# Altium schematic sheet MCU.SchDoc: Microcontroller
size A3; Organization: Senior Design Project; Address1: Prosthetic Hand; Address2: Matthew Varas; Address3: Rachel Mertz; Address4: Donnell Jones; DocumentNumber: 3; Revision: 1.1; SheetNumber: 3; SheetTotal: 6; DocumentName: 3
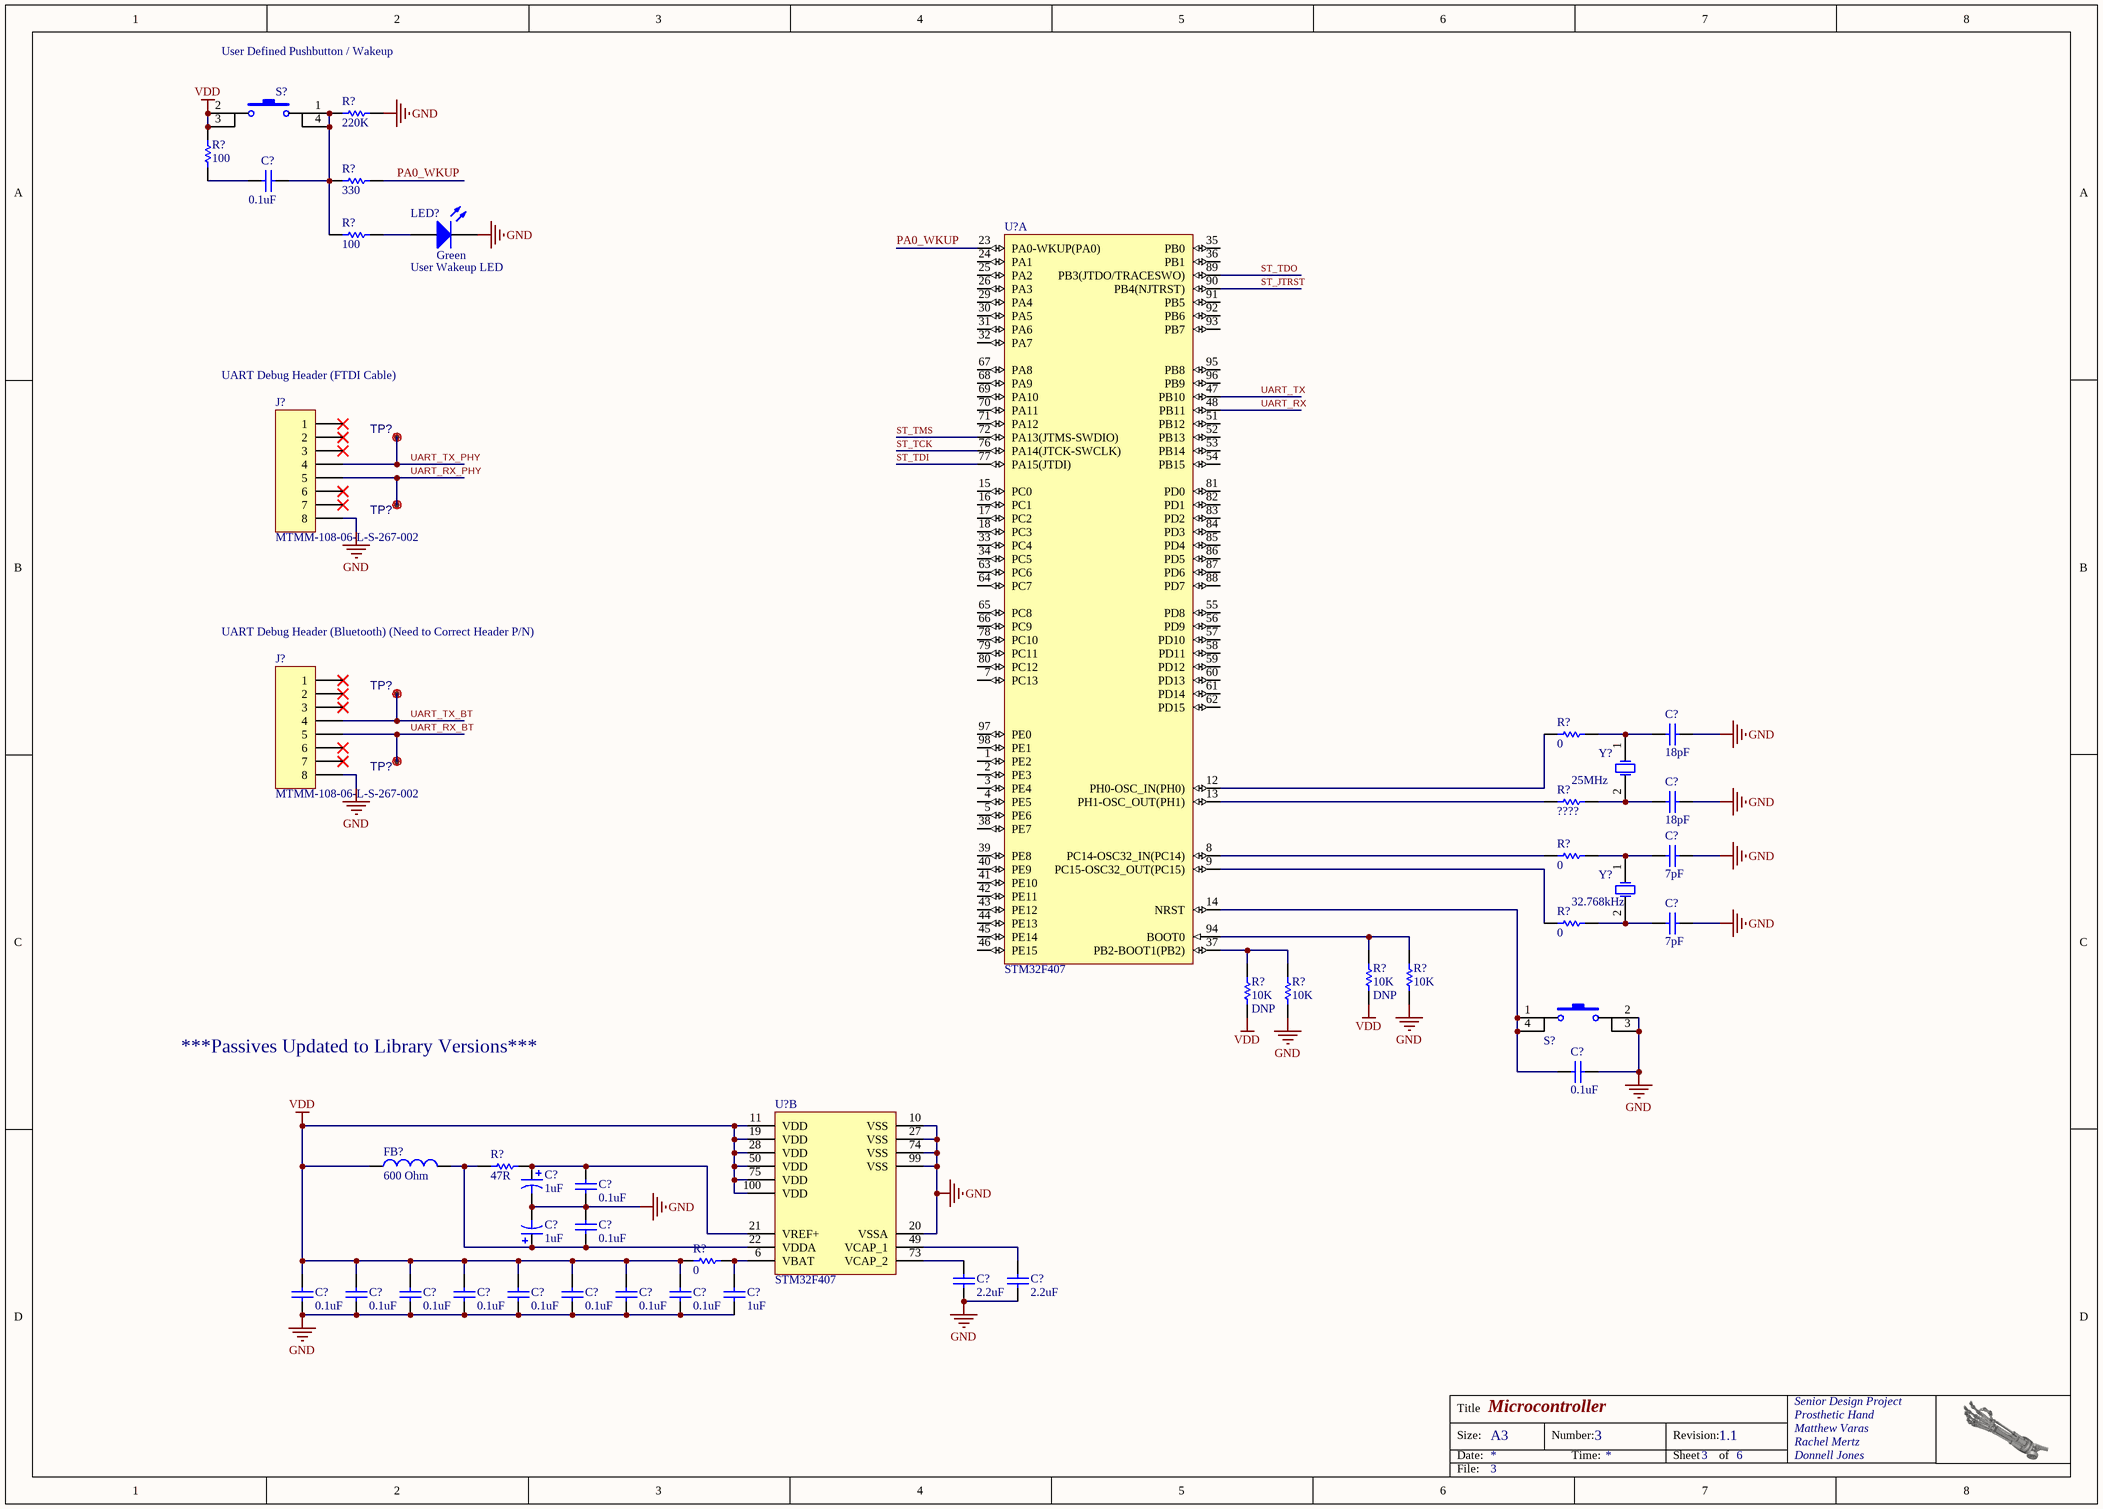
[diagram p0: MCU.SchDoc]

## Parts
(Parts that share a designator on the sheet are numbered #1, #2 ... from top to bottom, then left to right.)
C?#1  value 0.1uF  [0402 Cap]  (hidden comment: Cap)
C?#2  value 18pF  [0603 Cap]  (hidden comment: Cap)
C?#3  value 18pF  [0603 Cap]  (hidden comment: Cap)
C?#4  value 7pF  [0603 Cap]  (hidden comment: Cap)
C?#5  value 7pF  [0603 Cap]  (hidden comment: Cap)
C?#6  value 0.1uF  [0402 Cap]  (hidden comment: Cap)
C?#7  value 1uF  [Cap Tant A]  (hidden comment: Cap Tant)
C?#8  value 0.1uF  [0402 Cap]  (hidden comment: Cap)
C?#9  value 0.1uF  [0402 Cap]  (hidden comment: Cap)
C?#10  value 1uF  [Cap Tant A]  (hidden comment: Cap Tant)
C?#11  value 0.1uF  [0402 Cap]  (hidden comment: Cap)
C?#12  value 0.1uF  [0402 Cap]  (hidden comment: Cap)
C?#13  value 0.1uF  [0402 Cap]  (hidden comment: Cap)
C?#14  value 0.1uF  [0402 Cap]  (hidden comment: Cap)
C?#15  value 0.1uF  [0402 Cap]  (hidden comment: Cap)
C?#16  value 0.1uF  [0402 Cap]  (hidden comment: Cap)
C?#17  value 0.1uF  [0402 Cap]  (hidden comment: Cap)
C?#18  value 0.1uF  [0402 Cap]  (hidden comment: Cap)
C?#19  value 2.2uF  [1206 Cap]  (hidden comment: Cap)
C?#20  value 2.2uF  [1206 Cap]  (hidden comment: Cap)
C?#21  value 1uF  [0603 Cap]  (hidden comment: Cap)
FB?  value 600 Ohm  [0603 Resistor]  (hidden comment: Ferrite Bead)
J?#1  MFG_PN01: MTMM-108-06-L-S-267-002  [2mm_1x8_2NC]  (hidden comment: JTAG Header)
J?#2  MFG_PN01: MTMM-108-06-L-S-267-002  [2mm_1x8_2NC]  (hidden comment: JTAG Header)
LED?  User Wakeup LED  Color: Green  [LED 0603]
R?#1  value 220K  [0402 Resistor]  (hidden comment: Resistor)
R?#2  value 100  [0402 Resistor]  (hidden comment: Resistor)
R?#3  value 330  [0402 Resistor]  (hidden comment: Resistor)
R?#4  value 100  [0402 Resistor]  (hidden comment: Resistor)
R?#5  value 0  [0603 Resistor]  (hidden comment: Resistor)
R?#6  value ????  [0603 Resistor]  (hidden comment: Resistor)
R?#7  value 0  [0603 Resistor]  (hidden comment: Resistor)
R?#8  value 0  [0603 Resistor]  (hidden comment: Resistor)
R?#9  value 10K  [0402 Resistor]  (hidden comment: Resistor)
R?#10  value 10K  [0402 Resistor]  (hidden comment: Resistor)
R?#11  value 10K  [0402 Resistor]  (hidden comment: Resistor)
R?#12  value 10K  [0402 Resistor]  (hidden comment: Resistor)
R?#13  value 47R  [0603 Resistor]  (hidden comment: Resistor)
R?#14  value 0  [0603 Resistor]  (hidden comment: Resistor)
S?#1  SW-PB  [MJTP1138 Switch]  (value not drawn)
S?#2  SW-PB  [MJTP1138 Switch]  (value not drawn)
TP?#1  Test Point  [Testpoint_70]  (value not drawn)
TP?#2  Test Point  [Testpoint_70]  (value not drawn)
TP?#3  Test Point  [Testpoint_70]  (value not drawn)
TP?#4  Test Point  [Testpoint_70]  (value not drawn)
U?#1  STM32F407  [STM-LQFP100_V]  (part A of 2)
U?#2  STM32F407  [STM-LQFP100_V]  (part B of 2)
Y?#1  Frequency: 25MHz  [HC49/US Crystal]  (hidden comment: Crystal)
Y?#2  Frequency: 32.768kHz  [ECX-31B Crystal]  (hidden comment: Crystal)

## Nets
GND: C?#2.1 C?#3.1 C?#4.1 C?#5.1 C?#6.2 C?#7.2 C?#8.2 C?#9.1 C?#10.2 C?#11.2 C?#12.2 C?#13.2 C?#14.2 C?#15.2 C?#16.2 C?#17.2 C?#18.2 C?#19.1 C?#20.1 C?#21.1 J?#1.8 J?#2.8 LED?.2(K) R?#1.2 R?#10.1 R?#12.1 S?#2.2 S?#2.3 U?#2.10(VSS) U?#2.20(VSSA) U?#2.27(VSS) U?#2.74(VSS) U?#2.99(VSS)
VDD: C?#11.1 C?#12.1 C?#13.1 C?#14.1 C?#15.1 C?#16.1 C?#17.1 C?#18.1 FB?.1 R?#2.2 R?#9.1 R?#11.1 R?#14.1 S?#1.2 S?#1.3 U?#2.11(VDD) U?#2.19(VDD) U?#2.28(VDD) U?#2.50(VDD) U?#2.75(VDD) U?#2.100(VDD)
PA0_WKUP: R?#3.2 U?#1.23(PA0-WKUP(PA0))
ST_JTRST: U?#1.90(PB4(NJTRST))
ST_TCK: U?#1.76(PA14(JTCK-SWCLK))
ST_TDI: U?#1.77(PA15(JTDI))
ST_TDO: U?#1.89(PB3(JTDO/TRACESWO))
ST_TMS: U?#1.72(PA13(JTMS-SWDIO))
UART_RX: U?#1.48(PB11)
UART_RX_BT: J?#2.5 TP?#4.1(M80)
UART_RX_PHY: J?#1.5 TP?#2.1(M80)
UART_TX: U?#1.47(PB10)
UART_TX_BT: J?#2.4 TP?#3.1(M80)
UART_TX_PHY: J?#1.4 TP?#1.1(M80)
NetC?#1_1: C?#1.1 R?#1.1 R?#3.1 R?#4.1 S?#1.1 S?#1.4
NetC?#1_2: C?#1.2 R?#2.1
NetC?#2_2: C?#2.2 R?#5.2 Y?#1.1(OSC1)
NetC?#3_2: C?#3.2 R?#6.2 Y?#1.2(OSC2)
NetC?#4_2: C?#4.2 R?#7.2 Y?#2.1(OSC1)
NetC?#5_2: C?#5.2 R?#8.2 Y?#2.2(OSC2)
NetC?#6_1: C?#6.1 S?#2.1 S?#2.4 U?#1.14(NRST)
NetC?#7_1: C?#7.1 C?#8.1 R?#13.2 U?#2.21(VREF+)
NetC?#9_2: C?#9.2 C?#10.1 FB?.2 R?#13.1 U?#2.22(VDDA)
NetC?#19_2: C?#19.2 U?#2.73(VCAP_2)
NetC?#20_2: C?#20.2 U?#2.49(VCAP_1)
NetC?#21_2: C?#21.2 R?#14.2 U?#2.6(VBAT)
NetLED?_1: LED?.1(A) R?#4.2
NetR?#5_1: R?#5.1 U?#1.12(PH0-OSC_IN(PH0))
NetR?#6_1: R?#6.1 U?#1.13(PH1-OSC_OUT(PH1))
NetR?#7_1: R?#7.1 U?#1.8(PC14-OSC32_IN(PC14))
NetR?#8_1: R?#8.1 U?#1.9(PC15-OSC32_OUT(PC15))
NetR?#9_2: R?#9.2 R?#10.2 U?#1.94(BOOT0)
NetR?#11_2: R?#11.2 R?#12.2 U?#1.37(PB2-BOOT1(PB2))

Not connected (* = marked no-connect by the designer): J?#1 1* 2* 3* 6* 7*; J?#2 1* 2* 3* 6* 7*; U?#1 1(PE2) 2(PE3) 3(PE4) 4(PE5) 5(PE6) 7(PC13) 15(PC0) 16(PC1) 17(PC2) 18(PC3) 24(PA1) 25(PA2) 26(PA3) 29(PA4) 30(PA5) 31(PA6) 32(PA7) 33(PC4) 34(PC5) 35(PB0) 36(PB1) 38(PE7) 39(PE8) 40(PE9) 41(PE10) 42(PE11) 43(PE12) 44(PE13) 45(PE14) 46(PE15) 51(PB12) 52(PB13) 53(PB14) 54(PB15) 55(PD8) 56(PD9) 57(PD10) 58(PD11) 59(PD12) 60(PD13) 61(PD14) 62(PD15) 63(PC6) 64(PC7) 65(PC8) 66(PC9) 67(PA8) 68(PA9) 69(PA10) 70(PA11) 71(PA12) 78(PC10) 79(PC11) 80(PC12) 81(PD0) 82(PD1) 83(PD2) 84(PD3) 85(PD4) 86(PD5) 87(PD6) 88(PD7) 91(PB5) 92(PB6) 93(PB7) 95(PB8) 96(PB9) 97(PE0) 98(PE1)

## Notes on the sheet
- User Defined Pushbutton / Wakeup
- UART Debug Header (FTDI Cable)
- UART Debug Header (Bluetooth) (Need to Correct Header P/N)
- ***Passives Updated to Library Versions***
- Title
- Size:
- Date:
- A3
- Number:
- Time:
- Revision:
- Sheet
- of
- File:

## Library data of the parts
C?#1 C?#6 C?#8 C?#9 C?#11-C?#18 = Cap 0402: 0.10µF ±10% 16V X7R Ceramic Capacitor 0402; DIGI_PN01: 311-1338-1-ND; MFG_PN01: CC0402KRX7R7BB104; MFG_NAME01: Yageo; Footprint: 0402
C?#2 C?#3 = Cap 0603: 18pF ±1% 50V C0G, NP0 Ceramic Capacitor 0603; DIGI_PN01: 490-9716-1-ND; MFG_PN01: GRM1885C1H180FA01D; MFG_NAME01: Murata; Footprint: 0603
C?#4 C?#5 = Cap 0603: 7pF ±0.1pF 50V C0G, NP0 Ceramic Capacitor 0603; DIGI_PN01: 1276-2135-1-ND; MFG_PN01: CL10C070BB8NNNC; MFG_NAME01: Samsung; Footprint: 0603
C?#7 C?#10 = Cap Tant A: Tantalum Cap A; MFG_PN01: TAJA105K016RNJ; MFG_NAME01: AVX Corporation; DIGI_PN01: 478-1649-2-ND
C?#19 C?#20 = Cap 1206: 2.2µF ±10% 16V X7R Ceramic Capacitor 1206; DIGI_PN01: 311-1957-1-ND; MFG_PN01: CC1206KKX7R7BB225; MFG_NAME01: Yageo; Footprint: 1206
C?#21 = Cap 0603: 1µF ±10% 16V X5R Ceramic Capacitor 0603; DIGI_PN01: 311-1444-1-ND; MFG_PN01: CC0603KRX5R7BB105; MFG_NAME01: Yageo; Footprint: 0603
FB? = Inductor: FERRITE BEAD 600 OHM 0603 1LN; MFG_PN01: BK1608HS601-T; MFG_NAME01: Taiyo Yuden; DIGI_PN01: 587-1874-1-ND; Footprint: 0603
J?#1 J?#2 = JTAG Header: Header 8-pin keyed for FTDI Cable; MFG_NAME01: Samtec; DIGI_PN01: *
LED? = LED Green SMD: LED GREEN DIFFUSED 0603 SMD; MFG_PN01: SML-D12M8WT86; DIGI_PN01: 511-1578-1-ND; MFG_NAME01: Rohm Semiconductor; Published: 8-Jun-2000; LatestRevisionDate: 08-Jul-2005; LatestRevisionNote: Mech Layer 1 removed.; PackageReference: LED-1; Publisher: Altium Limited; PackageDescription: LED; 2 Leads
R?#1 = Resistor 0402: RES SMD 220K OHM 1% 1/16W 0402; MFG_PN01: AC0402FR-07220KL; MFG_NAME01: Yageo; DIGI_PN01: 311-220KLBCT-ND; Footprint: 0402
R?#2 R?#4 = Resistor 0402: RES SMD 100 OHM 1% 1/16W 0402; MFG_PN01: 311-100LRCT-ND; MFG_NAME01: RC0402FR-07100RL; DIGI_PN01: Yageo; Footprint: 0402
R?#3 = Resistor 0402: RES SMD 330 OHM 1% 1/16W 0402; MFG_PN01: RC0402FR-07330RL; MFG_NAME01: Yageo; DIGI_PN01: 311-330LRCT-ND; Footprint: 0402
R?#5 R?#7 R?#8 R?#14 = Resistor 0603: RES SMD 0.0OHM JUMPER 1/10W 0603; MFG_PN01: RC0603JR-070RL; MFG_NAME01: Yageo; DIGI_PN01: 311-0.0GRCT-ND; Footprint: 0603
R?#6 = Resistor 0603: *; MFG_PN01: *; MFG_NAME01: *; Footprint: 0603; DIGI_PN01: *
R?#9-R?#12 = Resistor 0402: RES SMD 10K OHM 1% 1/16W 0402; MFG_PN01: RC0402FR-0710KL; MFG_NAME01: Yageo; DIGI_PN01: 311-10.0KLRCT-ND; Footprint: 0402; DNP: DNP
R?#13 = Resistor 0603: RES SMD 47 OHM 1% 1/10W 0603; MFG_PN01: RC0603FR-0747RL; MFG_NAME01: Yageo; DIGI_PN01: 311-47.0HRCT-ND; Footprint: 0603
S?#1 S?#2 = SW-PB: SWITCH TACTILE SPST-NO 0.05A 12V; MFG_PN01: MJTP1138ATR; MFG_NAME01: Apem Inc.; DIGI_PN01: 679-2413-1-ND
  S?#2: Published: 24-Mar-1999; LatestRevisionDate: 17-Jul-2002; LatestRevisionNote: Re-released for DXP Platform.; PackageReference: SPST-2; Publisher: Altium Limited; PackageDescription: Switch; 2 Leads
TP?#1-TP?#4 = Test Point: Test Pad; MFG_PN01: DNP; MFG_NAME01: DNP; DNP: DNP
U?#1 U?#2 = STM32F507VGT6: IC MCU 32BIT 1MB FLASH 100LQFP; MFG_PN01: STM32F407VGT6; MFG_NAME01: STMicroelectronics; DIGI_PN01: 497-11605-ND; Footprint: 100-LQFP
Y?#1 = Crystal: 25MHz ±20ppm Crystal 18pF 30 Ohm; MFG_NAME01: ECS Inc.; MFG_PN01: ECS-250-18-5PX-JEM-TR; DIGI_PN01: XC2083CT-ND
Y?#2 = Crystal: 32.768kHz ±20ppm Crystal 7pF 70 kOhm; MFG_NAME01: ECS Inc.; MFG_PN01: ECS-.327-7-34B-TR; DIGI_PN01: XC1656CT-ND